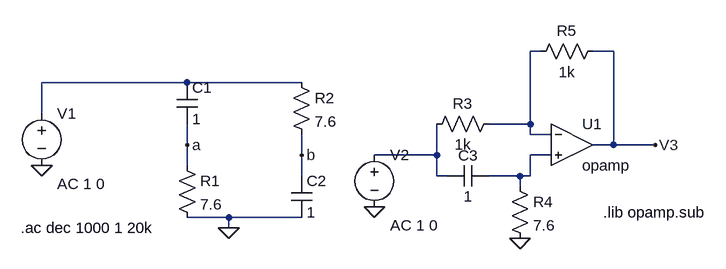
[diagram p0: schematic lattice-tarea4.asc]
lattice-tarea4.asc, the LTspice schematic file:
Version 4
SHEET 1 980 680
WIRE 704 32 688 32
WIRE 816 32 784 32
WIRE 160 80 -64 80
WIRE 336 80 160 80
WIRE -64 128 -64 80
WIRE 688 144 688 32
WIRE 688 144 624 144
WIRE 688 160 688 144
WIRE 720 160 688 160
WIRE 160 176 160 144
WIRE 816 176 816 32
WIRE 816 176 784 176
WIRE 880 176 816 176
WIRE 336 192 336 160
WIRE 544 192 544 144
WIRE 544 192 448 192
WIRE 720 192 688 192
WIRE 160 208 160 176
WIRE 336 224 336 192
WIRE 544 224 544 192
WIRE 560 224 544 224
WIRE 672 224 624 224
WIRE 688 224 688 192
WIRE 688 224 672 224
WIRE 672 240 672 224
WIRE 224 288 160 288
WIRE 336 288 224 288
WIRE 224 304 224 288
FLAG -64 208 0
FLAG 224 304 0
FLAG 160 176 a
FLAG 336 192 b
FLAG 672 320 0
FLAG 880 176 V3
FLAG 448 272 0
SYMBOL voltage -64 112 R0
WINDOW 123 24 124 Left 2
WINDOW 39 0 0 Left 0
SYMATTR Value2 AC 1 0
SYMATTR InstName V1
SYMATTR Value ""
SYMBOL cap 144 80 R0
SYMATTR InstName C1
SYMATTR Value 1
SYMBOL cap 320 224 R0
SYMATTR InstName C2
SYMATTR Value 1
SYMBOL res 144 192 R0
SYMATTR InstName R1
SYMATTR Value 7.6
SYMBOL res 320 64 R0
SYMATTR InstName R2
SYMATTR Value 7.6
SYMBOL Opamps\\opamp 752 112 R0
SYMATTR InstName U1
SYMBOL res 640 128 R90
WINDOW 0 0 56 VBottom 2
WINDOW 3 32 56 VTop 2
SYMATTR InstName R3
SYMATTR Value 1k
SYMBOL cap 624 208 R90
WINDOW 0 0 32 VBottom 2
WINDOW 3 32 32 VTop 2
SYMATTR InstName C3
SYMATTR Value 1
SYMBOL res 656 224 R0
SYMATTR InstName R4
SYMATTR Value 7.6
SYMBOL res 800 16 R90
WINDOW 0 0 56 VBottom 2
WINDOW 3 32 56 VTop 2
SYMATTR InstName R5
SYMATTR Value 1k
SYMBOL voltage 448 176 R0
WINDOW 123 24 124 Left 2
WINDOW 39 0 0 Left 0
SYMATTR Value2 AC 1 0
SYMATTR InstName V2
SYMATTR Value ""
TEXT -96 304 Left 2 !.ac dec 1000 1 20k
TEXT 800 280 Left 2 !.lib opamp.sub

The netlist it stands for:
* lattice-tarea4.asc
V1 N002 0 AC 1 0
C1 N002 a 1
C2 b 0 1
R1 a 0 7.6
R2 N002 b 7.6
XU1 N001 N004 V3 opamp Aol=100K GBW=10Meg  ; pins invin noninvin out
R3 N001 N003 1k
C3 N004 N003 1
R4 N004 0 7.6
R5 V3 N001 1k
V2 N003 0 AC 1 0
.ac dec 1000 1 20k
.lib opamp.sub
.backanno
.end